# Altium schematic sheet single_to_differential.SchDoc
size A4; CompanyName: Technische Hochschule Nürnberg Georg Simon Ohm; Address1: Fürther Straße 250; Address2: 90429 Nürnberg; Address3: GERMANY; SheetNumber: 5; SheetTotal: 21; CompanyName2: Institut ELSYS
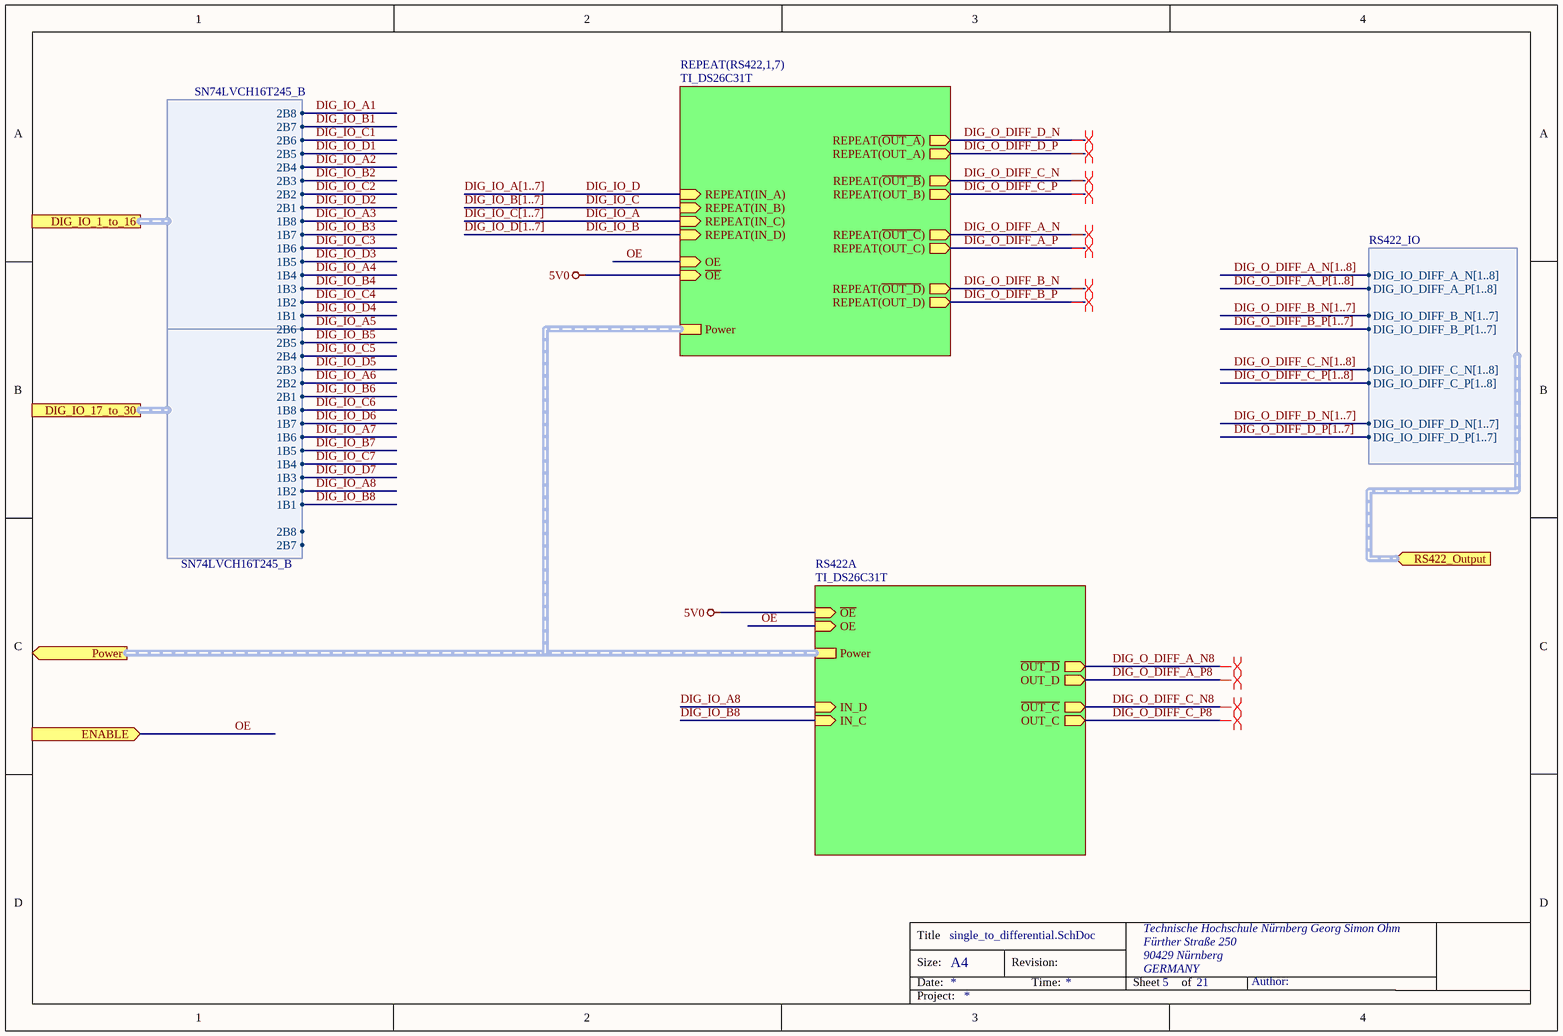
[diagram p0: single_to_differential.SchDoc]

## Sub-sheets
REPEAT(RS422,1,7) = TI_DS26C31T: REPEAT(IN_A) (in), REPEAT(IN_B) (in), REPEAT(IN_C) (in), REPEAT(IN_D) (in), REPEAT(~{OUT_A}) (out), REPEAT(OUT_A) (out), REPEAT(OUT_B) (out), REPEAT(~{OUT_B}) (out), REPEAT(~{OUT_C}) (out), REPEAT(OUT_C) (out), REPEAT(~{OUT_D}) (out), REPEAT(OUT_D) (out), OE (in), ~{OE} (in), Power (harness DS26C31T_Power)
RS422A = TI_DS26C31T: IN_D (in), IN_C (in), OUT_D (out), ~{OUT_D} (out), ~{OUT_C} (out), OUT_C (out), ~{OE} (in), OE (in), Power (harness DS26C31T_Power)

## Ports
DIG_IO_1_to_16 (harness SN74LVCH16T245_B), DIG_IO_17_to_30 (harness SN74LVCH16T245_B), ENABLE (in), Power (out, harness DS26C31T_Power), RS422_Output (in, harness RS422_IO)

## Harnesses
RS422_IO: DIG_IO_DIFF_A_N[1..8], DIG_IO_DIFF_A_P[1..8], DIG_IO_DIFF_B_N[1..7], DIG_IO_DIFF_B_P[1..7], DIG_IO_DIFF_C_P[1..8], DIG_IO_DIFF_C_N[1..8], DIG_IO_DIFF_D_P[1..7], DIG_IO_DIFF_D_N[1..7]
SN74LVCH16T245_B: 1B1, 1B2, 1B3, 1B4, 1B5, 1B6, 1B7, 1B8, 2B1, 2B2, 2B3, 2B4, 2B5, 2B6, 2B7, 2B8

## Nets
5V0: sheet RS422A/~{OE}, sheet REPEAT(RS422,1,7)/~{OE}
DIG_IO_A: sheet REPEAT(RS422,1,7)/REPEAT(IN_C)
DIG_IO_A1: port DIG_IO_1_to_16.2B8
DIG_IO_A2: port DIG_IO_1_to_16.2B4
DIG_IO_A3: port DIG_IO_1_to_16.1B8
DIG_IO_A4: port DIG_IO_1_to_16.1B4
DIG_IO_A5: port DIG_IO_17_to_30.2B6
DIG_IO_A6: port DIG_IO_17_to_30.2B2
DIG_IO_A7: port DIG_IO_17_to_30.1B6
DIG_IO_A8: sheet RS422A/IN_D, port DIG_IO_17_to_30.1B2
DIG_IO_B: sheet REPEAT(RS422,1,7)/REPEAT(IN_D)
DIG_IO_B1: port DIG_IO_1_to_16.2B7
DIG_IO_B2: port DIG_IO_1_to_16.2B3
DIG_IO_B3: port DIG_IO_1_to_16.1B7
DIG_IO_B4: port DIG_IO_1_to_16.1B3
DIG_IO_B5: port DIG_IO_17_to_30.2B5
DIG_IO_B6: port DIG_IO_17_to_30.2B1
DIG_IO_B7: port DIG_IO_17_to_30.1B5
DIG_IO_B8: sheet RS422A/IN_C, port DIG_IO_17_to_30.1B1
DIG_IO_C: sheet REPEAT(RS422,1,7)/REPEAT(IN_B)
DIG_IO_C1: port DIG_IO_1_to_16.2B6
DIG_IO_C2: port DIG_IO_1_to_16.2B2
DIG_IO_C3: port DIG_IO_1_to_16.1B6
DIG_IO_C4: port DIG_IO_1_to_16.1B2
DIG_IO_C5: port DIG_IO_17_to_30.2B4
DIG_IO_C6: port DIG_IO_17_to_30.1B8
DIG_IO_C7: port DIG_IO_17_to_30.1B4
DIG_IO_D: sheet REPEAT(RS422,1,7)/REPEAT(IN_A)
DIG_IO_D1: port DIG_IO_1_to_16.2B5
DIG_IO_D2: port DIG_IO_1_to_16.2B1
DIG_IO_D3: port DIG_IO_1_to_16.1B5
DIG_IO_D4: port DIG_IO_1_to_16.1B1
DIG_IO_D5: port DIG_IO_17_to_30.2B3
DIG_IO_D6: port DIG_IO_17_to_30.1B7
DIG_IO_D7: port DIG_IO_17_to_30.1B3
DIG_O_DIFF_A_N: sheet REPEAT(RS422,1,7)/REPEAT(~{OUT_C})
DIG_O_DIFF_A_N8: sheet RS422A/~{OUT_D}
DIG_O_DIFF_A_P: sheet REPEAT(RS422,1,7)/REPEAT(OUT_C)
DIG_O_DIFF_A_P8: sheet RS422A/OUT_D
DIG_O_DIFF_B_N: sheet REPEAT(RS422,1,7)/REPEAT(~{OUT_D})
DIG_O_DIFF_B_P: sheet REPEAT(RS422,1,7)/REPEAT(OUT_D)
DIG_O_DIFF_C_N: sheet REPEAT(RS422,1,7)/REPEAT(~{OUT_B})
DIG_O_DIFF_C_N8: sheet RS422A/~{OUT_C}
DIG_O_DIFF_C_P: sheet REPEAT(RS422,1,7)/REPEAT(OUT_B)
DIG_O_DIFF_C_P8: sheet RS422A/OUT_C
DIG_O_DIFF_D_N: sheet REPEAT(RS422,1,7)/REPEAT(~{OUT_A})
DIG_O_DIFF_D_P: sheet REPEAT(RS422,1,7)/REPEAT(OUT_A)
OE: port ENABLE, sheet RS422A/OE, sheet REPEAT(RS422,1,7)/OE

## Buses and harness runs
bus DIG_IO_A[1..7]
bus DIG_IO_B[1..7]
bus DIG_IO_C[1..7]
bus DIG_IO_D[1..7]
bus DIG_O_DIFF_A_N[1..8]
bus DIG_O_DIFF_A_P[1..8]
bus DIG_O_DIFF_B_N[1..7]
bus DIG_O_DIFF_B_P[1..7]
bus DIG_O_DIFF_C_N[1..8]
bus DIG_O_DIFF_C_P[1..8]
bus DIG_O_DIFF_D_N[1..7]
bus DIG_O_DIFF_D_P[1..7]
harness port Power = sheet REPEAT(RS422,1,7)/Power = sheet RS422A/Power

## Layout directives
differential pair: DIG_O_DIFF_A_N, DIG_O_DIFF_A_N8, DIG_O_DIFF_A_P, DIG_O_DIFF_A_P8, DIG_O_DIFF_B_N, DIG_O_DIFF_B_P, DIG_O_DIFF_C_N, DIG_O_DIFF_C_N8, DIG_O_DIFF_C_P, DIG_O_DIFF_C_P8, DIG_O_DIFF_D_N, DIG_O_DIFF_D_P

## Notes on the sheet
- Title
- Size:
- Date:
- A4
- Revision:
- Time:
- Sheet
- of
- Author:
- Project: